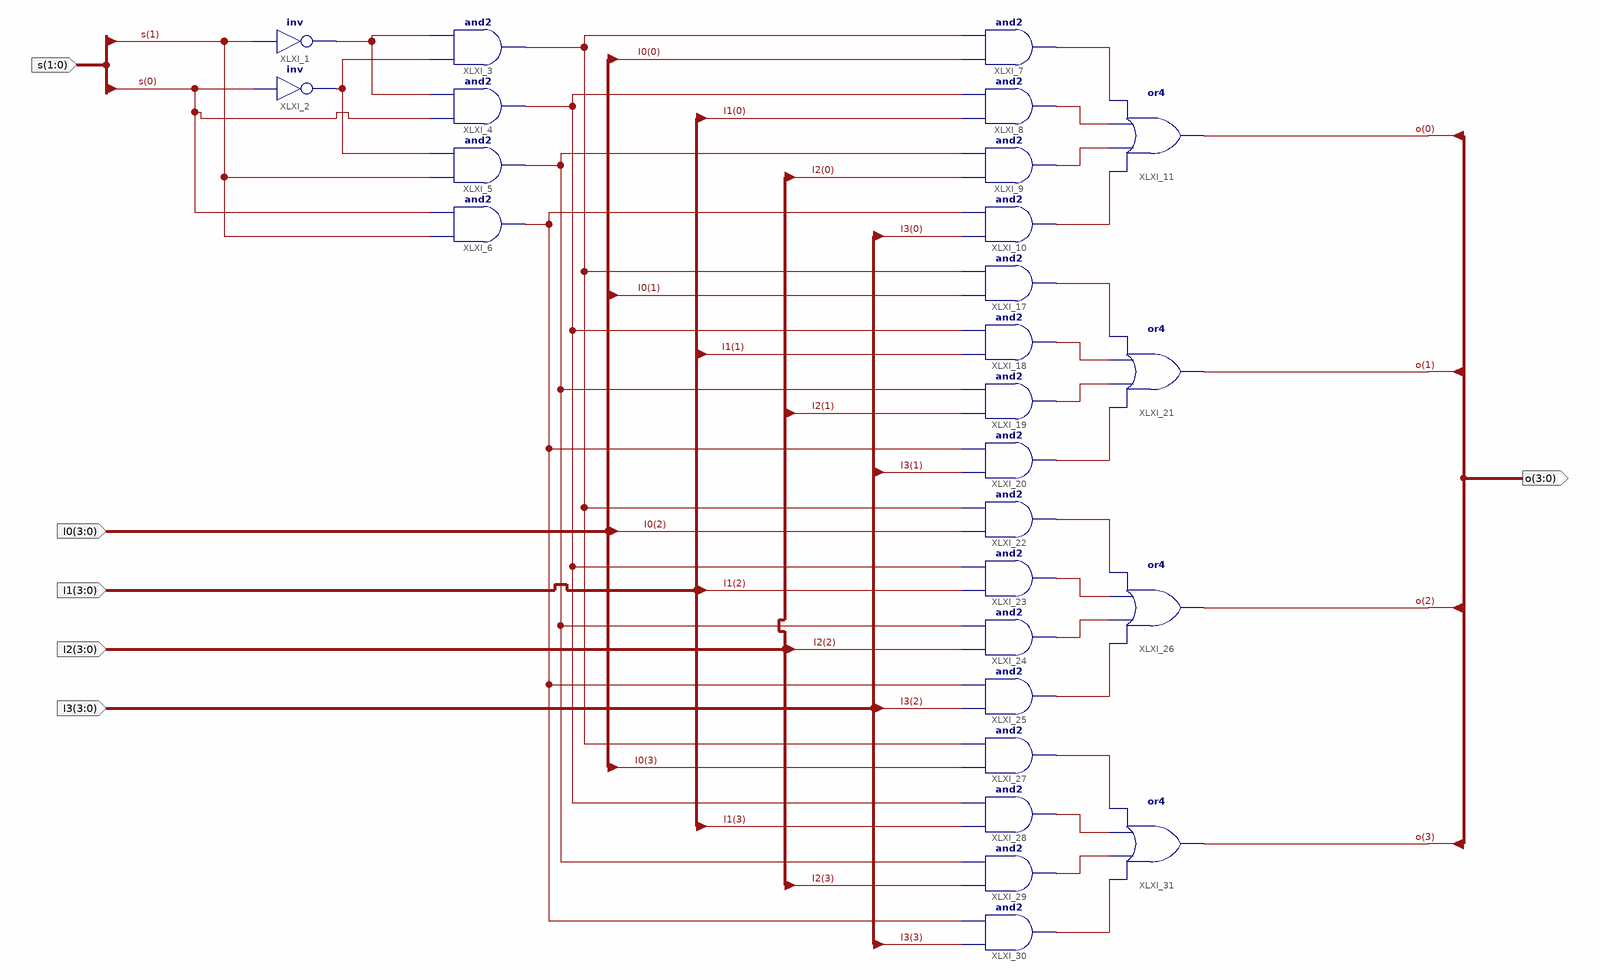
[diagram p0: schematic sheet 1]
// Xilinx ISE schematic Mux4to1b4_SCH.sch (kintex7) as structural Verilog: 26 symbols, 6 ports
module Mux4to1b4_SCH (
  input  [1:0] s,
  input  [3:0] I0,
  input  [3:0] I1,
  input  [3:0] I2,
  input  [3:0] I3,
  output [3:0] o
);

  wire XLXN_5, XLXN_6, XLXN_20, XLXN_21, XLXN_22, XLXN_23, XLXN_24, XLXN_25, XLXN_26, XLXN_27, XLXN_32,
       XLXN_33, XLXN_34, XLXN_35, XLXN_36, XLXN_37, XLXN_38, XLXN_39, XLXN_40, XLXN_41, XLXN_42, XLXN_43;

  not XLXI_1 (XLXN_5, s[1]);
  not XLXI_2 (XLXN_6, s[0]);
  and XLXI_3 (XLXN_27, XLXN_6, XLXN_5);
  and XLXI_4 (XLXN_26, s[0], XLXN_5);
  and XLXI_5 (XLXN_25, s[1], XLXN_6);
  and XLXI_6 (XLXN_24, s[1], s[0]);
  and XLXI_7 (XLXN_20, I0[0], XLXN_27);
  and XLXI_8 (XLXN_21, I1[0], XLXN_26);
  and XLXI_9 (XLXN_22, I2[0], XLXN_25);
  and XLXI_10 (XLXN_23, I3[0], XLXN_24);
  or XLXI_11 (o[0], XLXN_23, XLXN_22, XLXN_21, XLXN_20);
  and XLXI_17 (XLXN_32, I0[1], XLXN_27);
  and XLXI_18 (XLXN_33, I1[1], XLXN_26);
  and XLXI_19 (XLXN_34, I2[1], XLXN_25);
  and XLXI_20 (XLXN_35, I3[1], XLXN_24);
  or XLXI_21 (o[1], XLXN_35, XLXN_34, XLXN_33, XLXN_32);
  and XLXI_22 (XLXN_36, I0[2], XLXN_27);
  and XLXI_23 (XLXN_37, I1[2], XLXN_26);
  and XLXI_24 (XLXN_38, I2[2], XLXN_25);
  and XLXI_25 (XLXN_39, I3[2], XLXN_24);
  or XLXI_26 (o[2], XLXN_39, XLXN_38, XLXN_37, XLXN_36);
  and XLXI_27 (XLXN_40, I0[3], XLXN_27);
  and XLXI_28 (XLXN_41, I1[3], XLXN_26);
  and XLXI_29 (XLXN_42, I2[3], XLXN_25);
  and XLXI_30 (XLXN_43, I3[3], XLXN_24);
  or XLXI_31 (o[3], XLXN_43, XLXN_42, XLXN_41, XLXN_40);
endmodule
